# EAGLE design DiceLED (EAGLE 5.11)
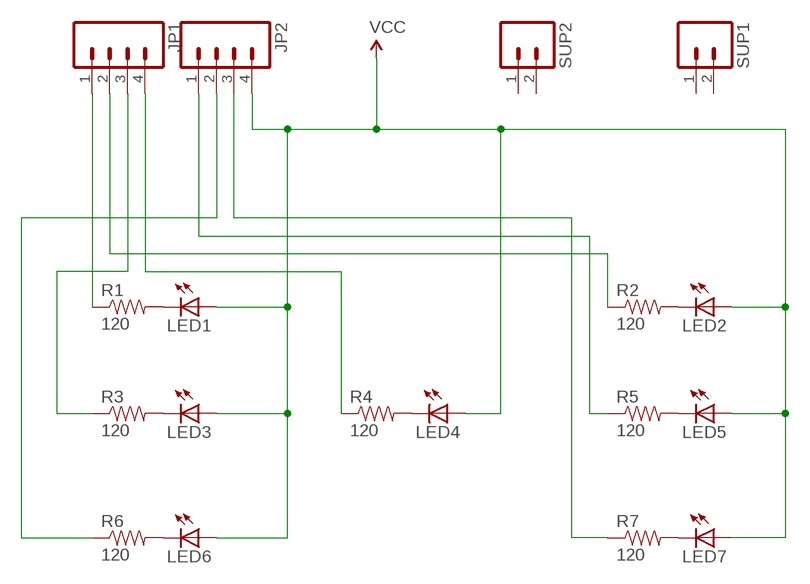
[diagram p0: schematic, sheet 1]

## Parts
JP1  M04LOCK  [1X04_LOCK]
JP2  M04LOCK  [1X04_LOCK]
LED1  LED10MM  [LED10MM]
LED2  LED10MM  [LED10MM]
LED3  LED10MM  [LED10MM]
LED4  LED10MM  [LED10MM]
LED5  LED10MM  [LED10MM]
LED6  LED10MM  [LED10MM]
LED7  LED10MM  [LED10MM]
R1  120  RESISTORPTH-1/4W  [AXIAL-0.4]
R2  120  RESISTORPTH-1/4W  [AXIAL-0.4]
R3  120  RESISTORPTH-1/4W  [AXIAL-0.4]
R4  120  RESISTORPTH-1/4W  [AXIAL-0.4]
R5  120  RESISTORPTH-1/4W  [AXIAL-0.4]
R6  120  RESISTORPTH-1/4W  [AXIAL-0.4]
R7  120  RESISTORPTH-1/4W  [AXIAL-0.4]
SUP1  M02LOCK  [1X02_LOCK]
SUP2  M02LOCK  [1X02_LOCK]

## Nets
N$1: LED7.C R7.P$2
N$2: LED5.C R5.P$2
N$3: LED2.C R2.P$2
N$4: LED4.C R4.P$2
N$5: LED1.C R1.P$2
N$6: LED3.C R3.P$2
N$7: LED6.C R6.P$2
N$8: JP1.1 R1.P$1
N$9: JP1.2 R2.P$1
N$10: JP1.3 R3.P$1
N$11: JP1.4 R4.P$1
N$12: JP2.1 R5.P$1
N$13: JP2.2 R6.P$1
N$14: JP2.3 R7.P$1
VCC: JP2.4 LED1.A LED2.A LED3.A LED4.A LED5.A LED6.A LED7.A
Unconnected: SUP1.1 SUP1.2 SUP2.1 SUP2.2

## Library data of the parts
JP1 JP2 = SparkFun:M04: Header 4 Standard 4-pin 0.1" header. Use with straight break away headers (SKU : PRT-00116), right angle break away headers (PRT-00553), swiss pins (PRT-00743), machine pins (PRT-00117), and female headers (PRT-00115). Molex polarized connector foot print use with SKU : PRT-08231 with associated crimp pins and housings.
LED1-LED7 = SparkFun:LED: LEDs Standard schematic elements and footprints for 5mm, 3mm, 1206, and 0603 sized LEDs. 5mm - Spark Fun Electronics SKU : COM-00529 (and others)
R1-R7 = SparkFun:RESISTOR: Resistor Basic schematic elements and footprints for 0603, 1206, and PTH resistors.
SUP1 SUP2 = SparkFun:M02: Header 2 Standard 2-pin 0.1" header. Use with straight break away headers (SKU : PRT-00116), right angle break away headers (PRT-00553), swiss pins (PRT-00743), machine pins (PRT-00117), and female headers (PRT-00115). Molex polarized connector foot print use with SKU : PRT-08233 with associated crimp pins and housings.

## Board
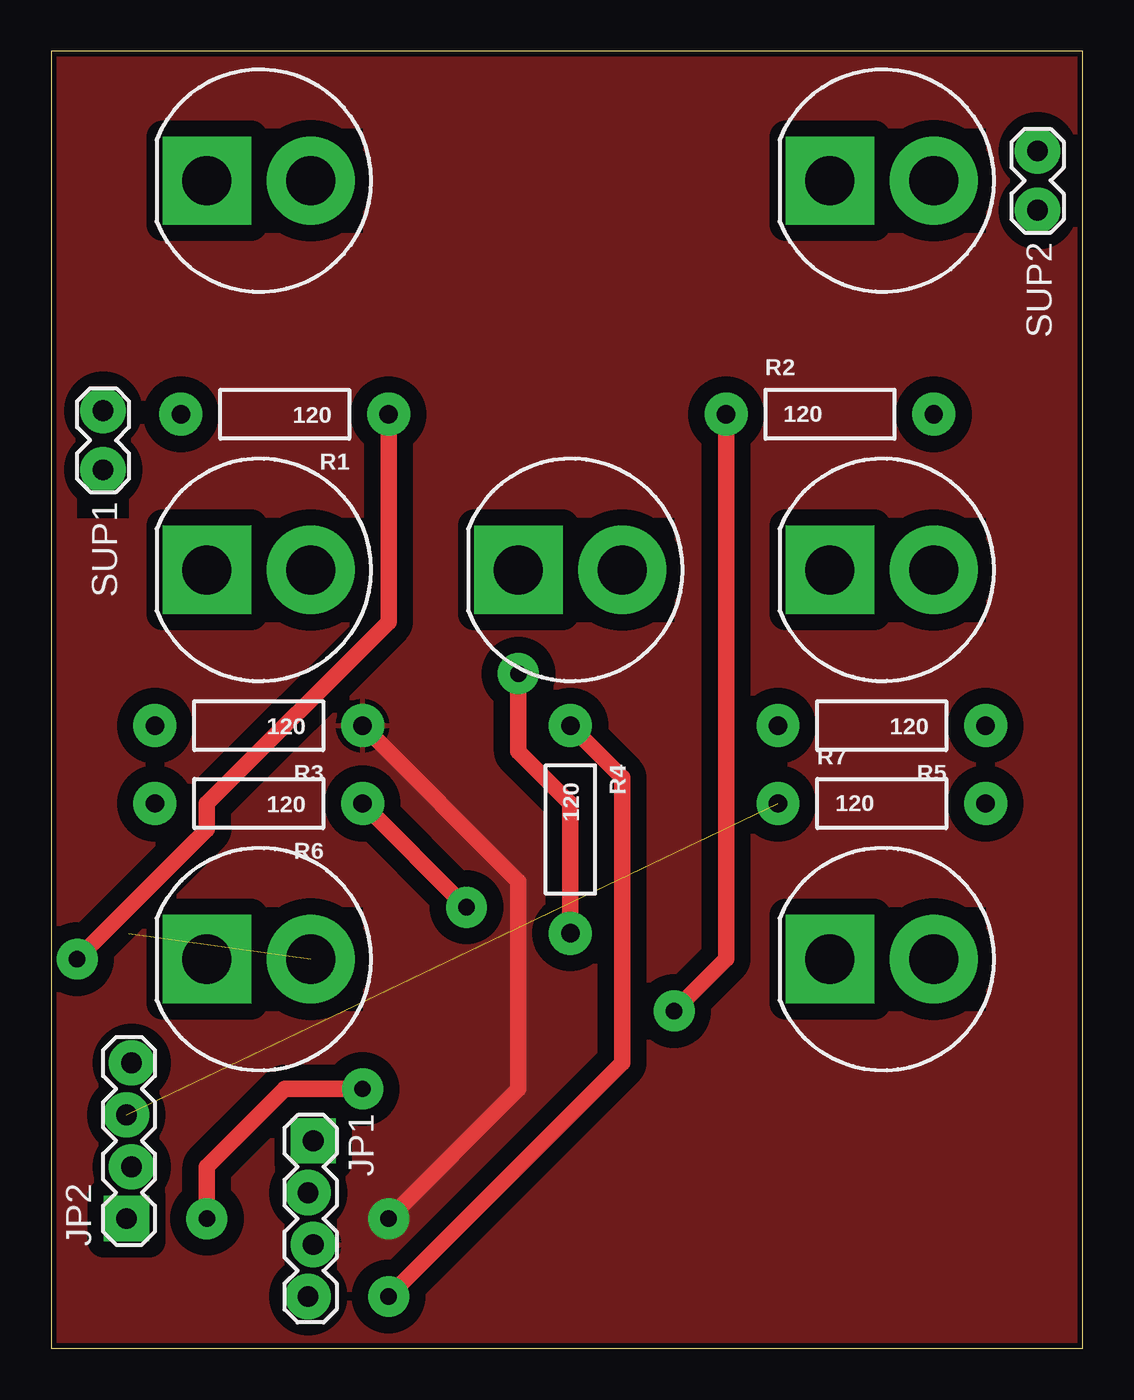
[diagram p1: board, top side]
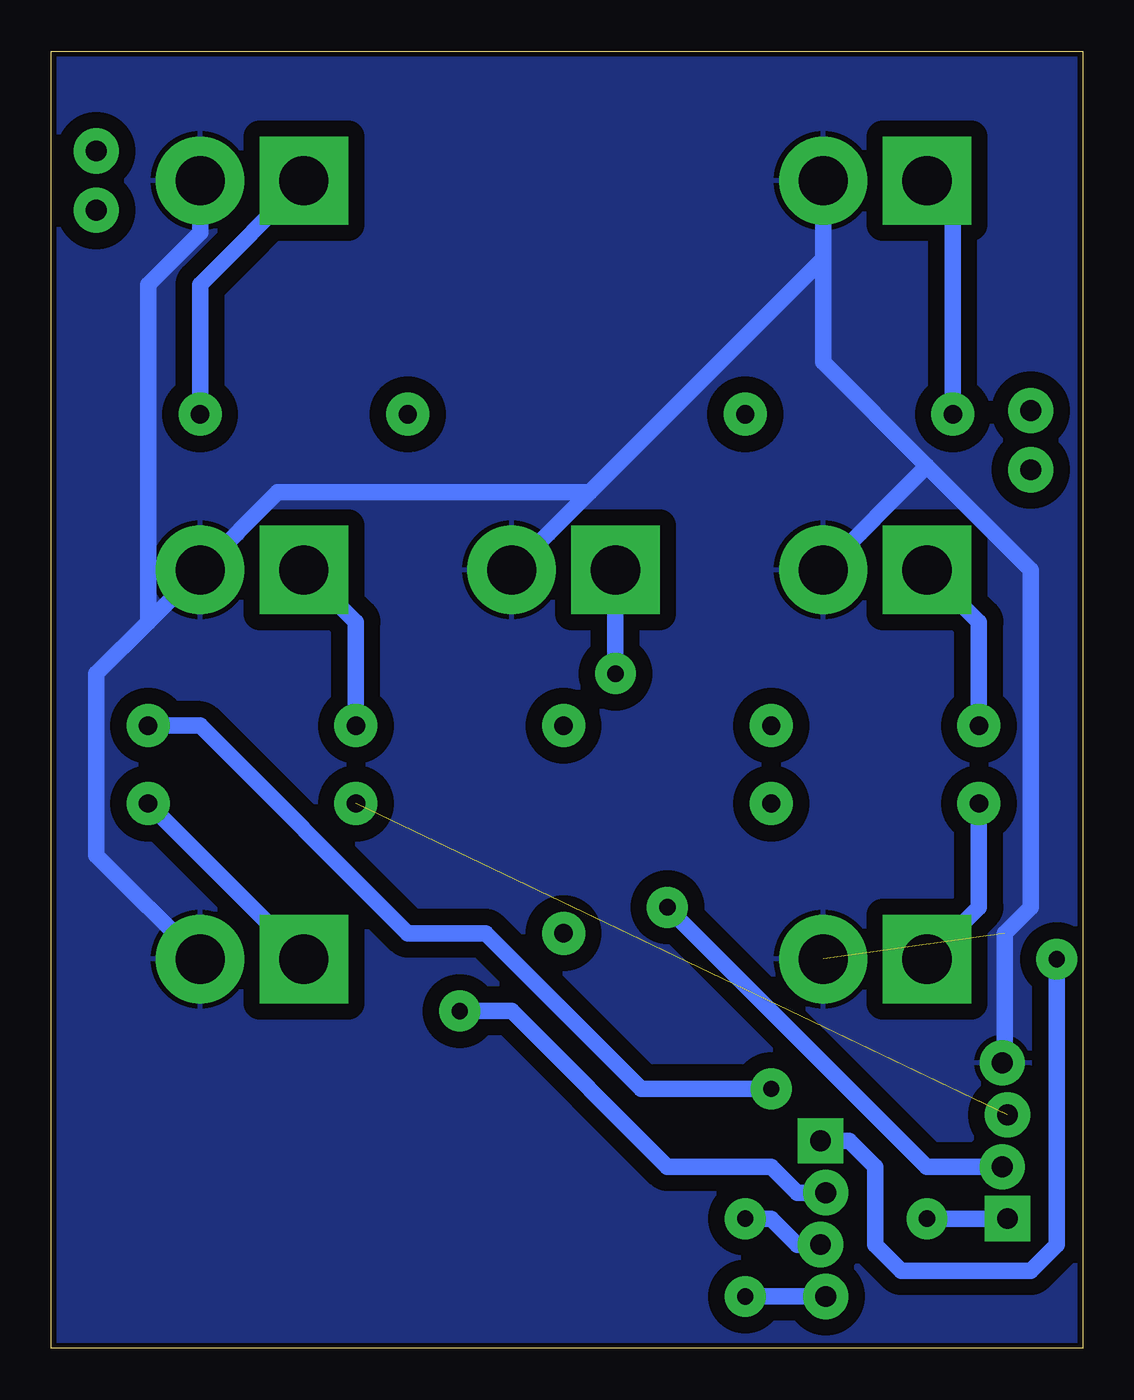
[diagram p2: board, bottom side, seen from below]

Size 50.47 x 63.49 mm. Coordinates in mm from the lower left corner, seen from the top.
Outline: 0,0 50.47,0 50.47,63.49 0,63.49 0,0
Copper layers (1*16): Top 0.035mm / dielectric 1.5mm / Bottom 0.035mm
Design rules "hobby": minimum track width 0.8mm, minimum drill 0.8mm, track to track 0.8mm, track to pad 0.8mm, pad to pad 0.45mm, via to via 0.8mm, smd to smd 8mil, copper to edge 10mil, drill to drill 8mil, minimum pad ring 0.6mm, minimum via ring 0.6mm, stop-mask expansion 4mil, vias tented up to drill 25mil, thermal gap 10mil
tRestrict: area 2.5,5.1 to 5.1,15.2; area 11.4,1.3 to 14,11.4; area 1.3,40.6 to 3.8,45.7; area 47,54.6 to 49.5,59.7; area 35.6,54.6 to 45.7,59.7; area 35.6,35.6 to 45.7,40.6; area 35.6,16.5 to 45.7,21.6; area 5.1,16.5 to 15.2,21.6; area 5.1,35.6 to 15.2,40.6; area 5.1,54.6 to 15.2,59.7; area 20.3,35.6 to 30.5,40.6

### Footprints (pad centres in the part's own frame; a part is rotated, then mirrored left to right if it is on the bottom)
1X04_LOCK = drill 1.016 pad 1.88 square: 1 0,0.127 | drill 1.016 pad 1.88 round: 2 2.54,-0.127; 3 5.08,0.127; 4 7.62,-0.127
LED10MM = drill 2.4 pad 3.7 round: A 2.54,0 | drill 2.4 pad 3.7 square: C -2.54,0
AXIAL-0.4 = drill 0.9 pad 1.88 round: P$1 -5.08,0; P$2 5.08,0
1X02_LOCK = drill 1.016 pad 1.88 round: 1 -0.178,0; 2 2.718,0

### Placement (x,y rotation side)
JP1  12.7,10.16 270 top
JP2  3.81,6.35 90 top
LED1  10.16,57.15 0 top
LED2  40.64,57.15 0 top
LED3  10.16,38.1 0 top
LED4  25.4,38.1 0 top
LED5  40.64,38.1 0 top
LED6  10.16,19.05 0 top
LED7  40.64,19.05 0 top
R1  11.43,45.72 180 top
R2  38.1,45.72 0 top
R3  10.16,30.48 180 top
R4  25.4,25.4 270 top
R5  40.64,30.48 180 top
R6  10.16,26.67 180 top
R7  40.64,26.67 0 top
SUP1  2.54,43.18 90 top
SUP2  48.26,55.88 90 top

### Tracks (layer width: path | path; a pad name or v marks a point on that pad's centre or on a via)
N$1
  Bottom 0.8: LED7.C R7.P$2
N$2
  Bottom 0.8: R5.P$2 35.56,35.56 LED5.C
N$3
  Bottom 0.8: R2.P$2 43.18,52.07 LED2.C
N$4  (via drill 0.8)
  Top 0.8: R4.P$2 25.4,26.67 22.86,29.21 v22.86,33.02
  Bottom 0.8: v22.86,33.02 LED4.C
N$5
  Bottom 0.8: R1.P$2 6.35,55.88 LED1.C
N$6
  Bottom 0.8: R3.P$2 5.08,35.56 LED3.C
N$7
  Bottom 0.8: R6.P$2 5.08,21.59 LED6.C
N$8  (via drill 0.8)
  Top 0.8: R1.P$1 16.51,35.56 7.62,26.67 7.62,25.4 v1.27,19.05
  Bottom 0.8: v1.27,19.05 1.27,5.08 2.54,3.81 8.89,3.81 10.16,5.08 10.16,8.89 11.43,10.16 JP1.1
N$9  (via drill 0.8)
  Top 0.8: R2.P$1 33.02,19.05 v30.48,16.51
  Bottom 0.8: v30.48,16.51 27.94,16.51 20.32,8.89 15.24,8.89 13.97,7.62 JP1.2
N$10  (via drill 0.8)
  Top 0.8: R3.P$1 22.86,22.86 22.86,12.7 v16.51,6.35
  Bottom 0.8: v16.51,6.35 15.24,6.35 13.97,5.08 JP1.3 12.7,5.08
  pour Top: -1.27,64.77 52.07,64.77 52.07,-1.27 -1.27,-1.27
N$11  (via drill 0.8)
  Top 0.8: R4.P$1 27.94,27.94 27.94,13.97 v16.51,2.54
  Bottom 0.8: JP1.4 v16.51,2.54
N$12  (via drill 0.8)
  Top 0.8: v15.24,12.7 11.43,12.7 7.62,8.89 v7.62,6.35
  Bottom 0.8: R5.P$1 43.18,30.48 33.02,20.32 29.21,20.32 21.59,12.7 v15.24,12.7 | JP2.1 v7.62,6.35
N$13  (via drill 0.8)
  Top 0.8: v20.32,21.59 R6.P$1
  Bottom 0.8: v20.32,21.59 7.62,8.89 JP2.2 3.81,8.89
N$14  (1 unrouted)
VCC  (1 unrouted)
  Bottom 0.8: LED7.A 48.26,24.13 48.26,33.02 45.72,35.56 | 45.72,35.56 LED5.A 39.37,41.91 24.13,41.91 | LED2.A 43.18,54.61 45.72,52.07 45.72,35.56 | 7.62,43.18 12.7,48.26 12.7,53.34 | 7.62,43.18 2.54,38.1 2.54,21.59 3.81,20.32 3.81,13.97 JP2.4 | 12.7,53.34 LED1.A | 7.62,43.18 LED3.A | 12.7,53.34 24.13,41.91 | 24.13,41.91 LED4.A
  pour Bottom: -1.27,64.77 52.07,64.77 52.07,-1.27 -1.27,-1.27